# EAGLE design smartwatch class 2 bottom (EAGLE 9.6.2)
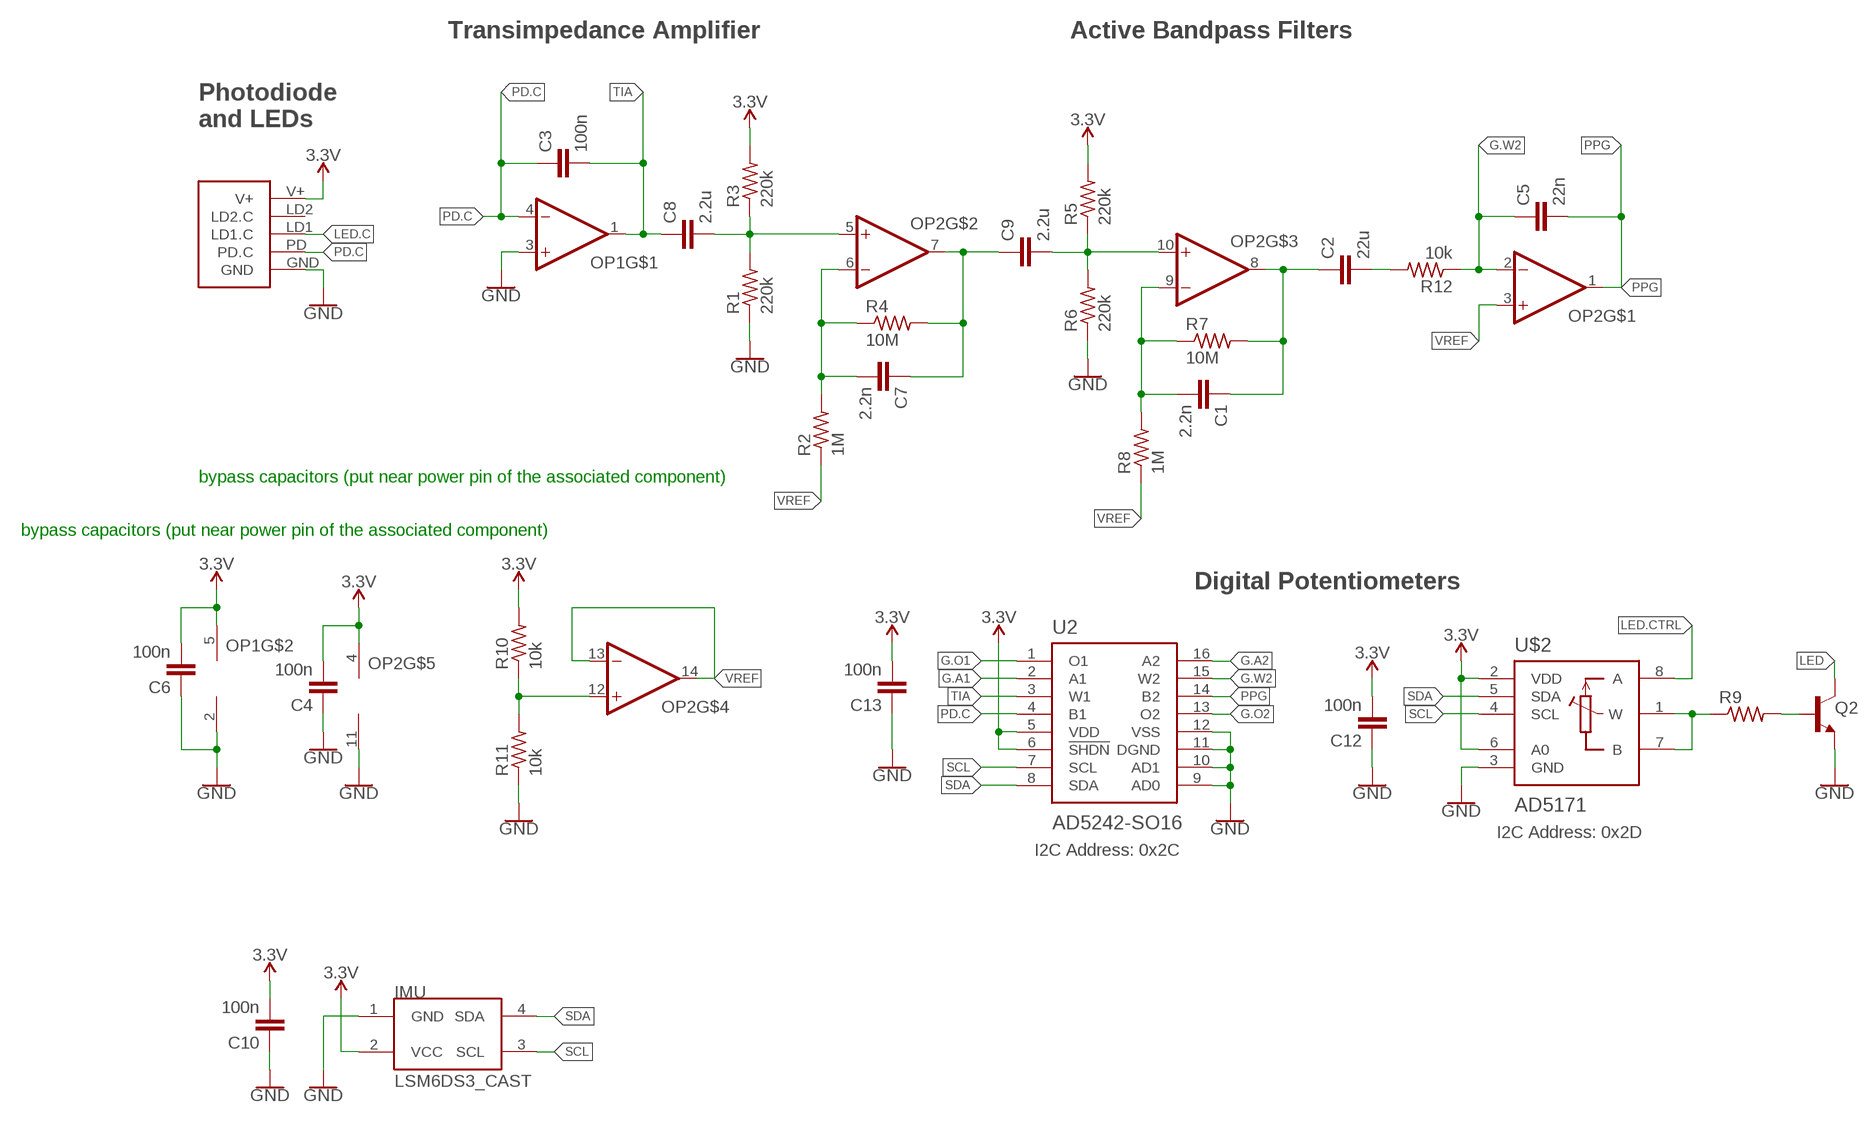
[diagram p0: schematic, sheet 1]

## Parts
C1  2.2n  CAPACITOR0603  [C0603]
C2  22u  CAPACITOR0603  [C0603]
C3  100n  CAPACITOR0603  [C0603]
C4  100n  CAPACITOR0603  [C0603]
C5  22n  CAPACITOR0603  [C0603]
C6  100n  CAPACITOR0603  [C0603]
C7  2.2n  CAPACITOR0603  [C0603]
C8  2.2u  CAPACITOR0603  [C0603]
C9  2.2u  CAPACITOR0603  [C0603]
C10  100n  CAPACITOR0603  [C0603]
C12  100n  CAPACITOR0603  [C0603]
C13  100n  CAPACITOR0603  [C0603]
IMU  LSM6DS3_CAST  [LSM6DS3_CAST]
OP1  OP-SINGLEOT  [SOT23-5]
OP2  OP-QUAD-SO14  [SO14]
Q2  NPN-GENERIC  [SOT23-3]
R1  220k  RESISTOR0603  [R0603]
R2  1M  RESISTOR0603  [R0603]
R3  220k  RESISTOR0603  [R0603]
R4  10M  RESISTOR0603  [R0603]
R5  220k  RESISTOR0603  [R0603]
R6  220k  RESISTOR0603  [R0603]
R7  10M  RESISTOR0603  [R0603]
R8  1M  RESISTOR0603  [R0603]
R9  RESISTOR0603  [R0603]
R10  10k  RESISTOR0402  [R0402]
R11  10k  RESISTOR0402  [R0402]
R12  10k  RESISTOR0603  [R0603]
U2  AD5242-SO16  [SO16]
U$1  PPG.MODULE.2  [PPG.MODULE.2]
U$2  AD5171  [SOT-23-8]

## Nets
3.3V: C4.2 C6.2 C10.2 C12.2 C13.2 IMU.2(VCC) OP1.5(V+) OP2.4(V+) R3.2 R5.2 R10.2 U2.5(VDD) U2.6(!SHDN) U$1.V+ U$2.2(VDD) U$2.6(A0)
G.A1: U2.2(A1)
G.A2: U2.16(A2)
G.O1: U2.1(O1)
G.O2: U2.13(O2)
G.W2: C5.1 OP2.2(-IN) R12.1 U2.15(W2)
GND: C4.1 C6.1 C10.1 C12.1 C13.1 IMU.1(GND) OP1.2(V-) OP1.3(+IN) OP2.11(V-) Q2.2(E) R1.1 R6.1 R11.1 U2.9(AD0) U2.10(AD1) U2.11(DGND) U2.12(VSS) U$1.GND U$2.3(GND)
LED: Q2.3(C)
LED.C: U$1.LD1(LD1.C)
LED.CTRL: U$2.8(A)
N$1: C8.2 OP2.5(+IN) R1.2 R3.1
N$2: C9.2 OP2.10(+IN) R5.1 R6.2
N$3: C7.2 OP2.6(-IN) R2.2 R4.1
N$4: C7.1 C9.1 OP2.7(OUT) R4.2
N$5: C1.2 OP2.9(-IN) R7.1 R8.2
N$6: C1.1 C2.1 OP2.8(OUT) R7.2
N$7: C2.2 R12.2
N$11: Q2.1(B) R9.2
N$12: R9.1 U$2.1(W) U$2.7(B)
N$14: OP2.12(+IN) R10.1 R11.2
PD.C: C3.1 OP1.4(-IN) U2.4(B1) U$1.PD(PD.C)
PPG: C5.2 OP2.1(OUT) U2.14(B2)
SCL: IMU.3(SCL) U2.7(SCL) U$2.4(SCL)
SDA: IMU.4(SDA) U2.8(SDA) U$2.5(SDA)
TIA: C3.2 C8.1 OP1.1(OUT) U2.3(W1)
VREF: OP2.3(+IN) OP2.13(-IN) OP2.14(OUT) R2.1 R8.1
Unconnected: U$1.LD2(LD2.C)

## Notes on the sheet
- Transimpedance Amplifier | Active Bandpass Filters
- Photodiode
  and LEDs
- bypass capacitors (put near power pin of the associated component)
- bypass capacitors (put near power pin of the associated component)
- Digital Potentiometers
- I2C Address: 0x2D
- I2C Address: 0x2C

## Library data of the parts
C1-C10 C12 C13 = LinnesLab-Passives:CAPACITOR
IMU = LinnesLab-Sensors:LSM6DS3_CAST
OP1 = LinnesLab-AnalogIC:OP-SINGLE: Single Op Amp 2.7V to 6.0V Single Supply CMOS Source: http://ww1.microchip.com/downloads/en/DeviceDoc/21314g.pdf
OP2 = LinnesLab-AnalogIC:OP-QUAD: General symbol and footprints for Quad Op Amps. Use with any standard general purpose op amp.
Q2 = LinnesLab-DiscreteSemi:NPN
R1-R12 = LinnesLab-Passives:RESISTOR
U2 = LinnesLab-DigitalIC:AD5242
U$1 = LinnesLab-Connectors:PPG.MODULE.2: Digi-Key Part Number: S9014E-50-ND Manufacturer Part Number: GRPB501VWVN-RC Description: 1mm insulation height 0.05in pitch 50 positions
U$2 = LinnesLab-DigitalIC:AD5171

## Board
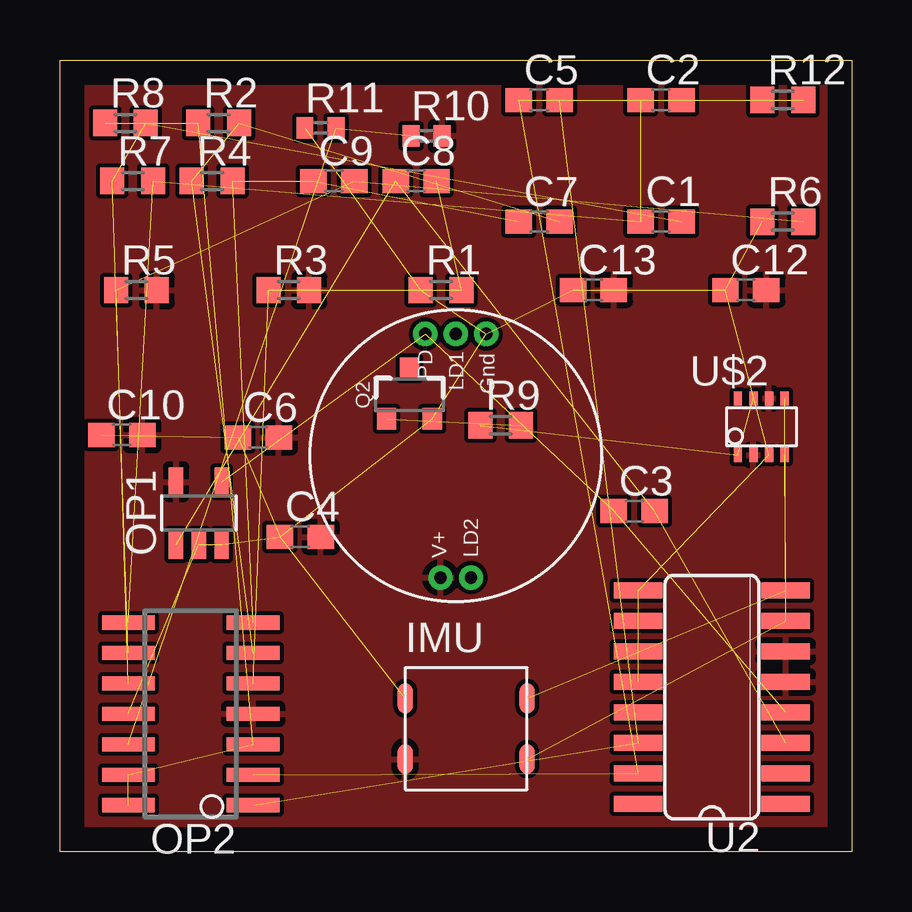
[diagram p1: board, top side]

Size 33 x 33 mm. Coordinates in mm from the lower left corner, seen from the top.
Outline: 0,33 33,33 33,0 0,0 0,33
Copper layers (1*16): Top 0.035mm / dielectric 1.5mm / Bottom 0.035mm
Design rules "default": minimum track width 6mil, minimum drill 0.35mm, track to track 6mil, track to pad 6mil, pad to pad 6mil, via to via 6mil, smd to smd 6mil, copper to edge 40mil, drill to drill 6mil, minimum pad ring 10mil, minimum via ring 8mil, stop-mask expansion 4mil, vias tented up to drill 0mil, thermal gap 10mil

### Footprints (pad centres in the part's own frame; a part is rotated, then mirrored left to right if it is on the bottom)
C0603 = smd 1.1 x 1: 1 -0.85,0; 2 0.85,0
LSM6DS3_CAST = smd 0.635 x 1.27: 1 -2.54,1.27; 2 -2.54,-1.27; 3 2.54,-1.27; 4 2.54,1.27
SOT23-5 = smd 0.6 x 1.2: 1 -0.95,-1.306; 2 0,-1.306; 3 0.95,-1.306; 4 0.95,1.306; 5 -0.95,1.306
SO14 = smd 0.6 x 2.2: 1 -3.81,-2.6; 2 -2.54,-2.6; 3 -1.27,-2.6; 4 0,-2.6; 5 1.27,-2.6; 6 2.54,-2.6; 7 3.81,-2.6; 8 3.81,2.6; 9 2.54,2.6; 10 1.27,2.6; 11 0,2.6; 12 -1.27,2.6; 13 -2.54,2.6; 14 -3.81,2.6
SOT23-3 = smd 0.8 x 0.9: 1 -0.95,-1; 2 0.95,-1; 3 0,1.1
R0603 = smd 1 x 1.1: 1 -0.85,0; 2 0.85,0
R0402 = smd 0.7 x 0.9: 1 -0.65,0; 2 0.65,0
SO16 = smd 0.66 x 2.032: 1 -4.445,-3.073; 2 -3.175,-3.073; 3 -1.905,-3.073; 4 -0.635,-3.073; 5 0.635,-3.073; 6 1.905,-3.073; 7 3.175,-3.073; 8 4.445,-3.073; 9 4.445,3.073; 10 3.175,3.073; 11 1.905,3.073; 12 0.635,3.073; 13 -0.635,3.073; 14 -1.905,3.073; 15 -3.175,3.073; 16 -4.445,3.073
PPG.MODULE.2 = drill 0.508 pad 0.94: GND 1.27,5.08; LD1 0,5.08; LD2 0.635,-5.08; PD -1.27,5.08; V+ -0.635,-5.08
SOT-23-8 = smd 0.35 x 0.6: 1 -0.991,-1.176; 2 -0.341,-1.176; 3 0.309,-1.176; 4 0.959,-1.176; 5 0.959,1.176; 6 0.309,1.176; 7 -0.341,1.176; 8 -0.991,1.176

### Placement (x,y rotation side)
C1  25.06,26.25 0 top
C2  25.06,31.33 0 top
C3  23.94,14.19 0 top
C4  10.02,13.12 0 top
C5  19.98,31.33 0 top
C6  8.27,17.26 0 top
C7  19.98,26.25 0 top
C8  14.85,27.95 0 top
C9  11.42,27.95 0 top
C10  2.58,17.36 0 top
C12  28.59,23.41 0 top
C13  22.24,23.41 0 top
IMU  16.93,5.12 0 top
OP1  5.79,14.11 0 top
OP2  5.45,5.74 90 top
Q2  14.57,19.04 0 top
R1  15.89,23.41 0 top
R2  6.62,30.37 0 top
R3  9.54,23.41 0 top
R4  6.34,27.95 0 top
R5  3.19,23.41 0 top
R6  30.14,26.25 0 top
R7  3.04,27.95 0 top
R8  2.73,30.37 0 top
R9  18.38,17.77 0 top
R10  15.28,29.83 0 top
R11  10.86,30.16 0 top
R12  30.14,31.33 0 top
U2  27.18,6.44 90 top
U$1  16.5,16.5 0 top
U$2  29.25,17.71 0 top

### Tracks (layer width: path | path; a pad name or v marks a point on that pad's centre or on a via)
3.3V
  pour Top (isolate 0.178): 0.52,32.37 0.52,0.52 32.32,0.52 32.32,32.37
G.W2  (3 unrouted)
GND  (18 unrouted)
N$1  (3 unrouted)
N$2  (3 unrouted)
N$3  (3 unrouted)
N$4  (3 unrouted)
N$5  (3 unrouted)
N$6  (3 unrouted)
N$7  (1 unrouted)
N$11  (1 unrouted)
N$12  (2 unrouted)
N$14  (2 unrouted)
PD.C  (3 unrouted)
PPG  (2 unrouted)
SCL  (2 unrouted)
SDA  (2 unrouted)
TIA  (3 unrouted)
VREF  (4 unrouted)